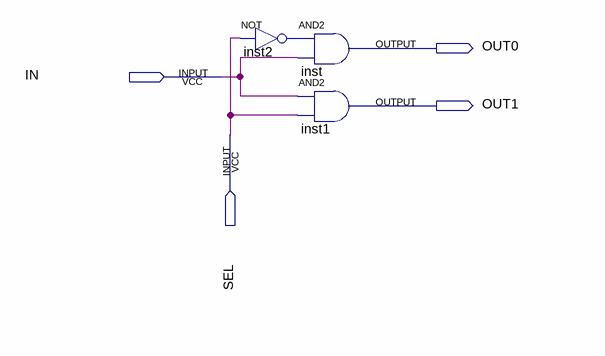
[diagram p0: schematic sheet]
// Quartus schematic DEMUX.bdf as structural Verilog: 3 symbols, 4 pins
module DEMUX (
  input  IN,
  input  SEL,
  output OUT0,
  output OUT1
);

  wire inst2_out;

  not inst2 (inst2_out, SEL);
  and inst (OUT0, inst2_out, IN);
  and inst1 (OUT1, IN, SEL);
endmodule
